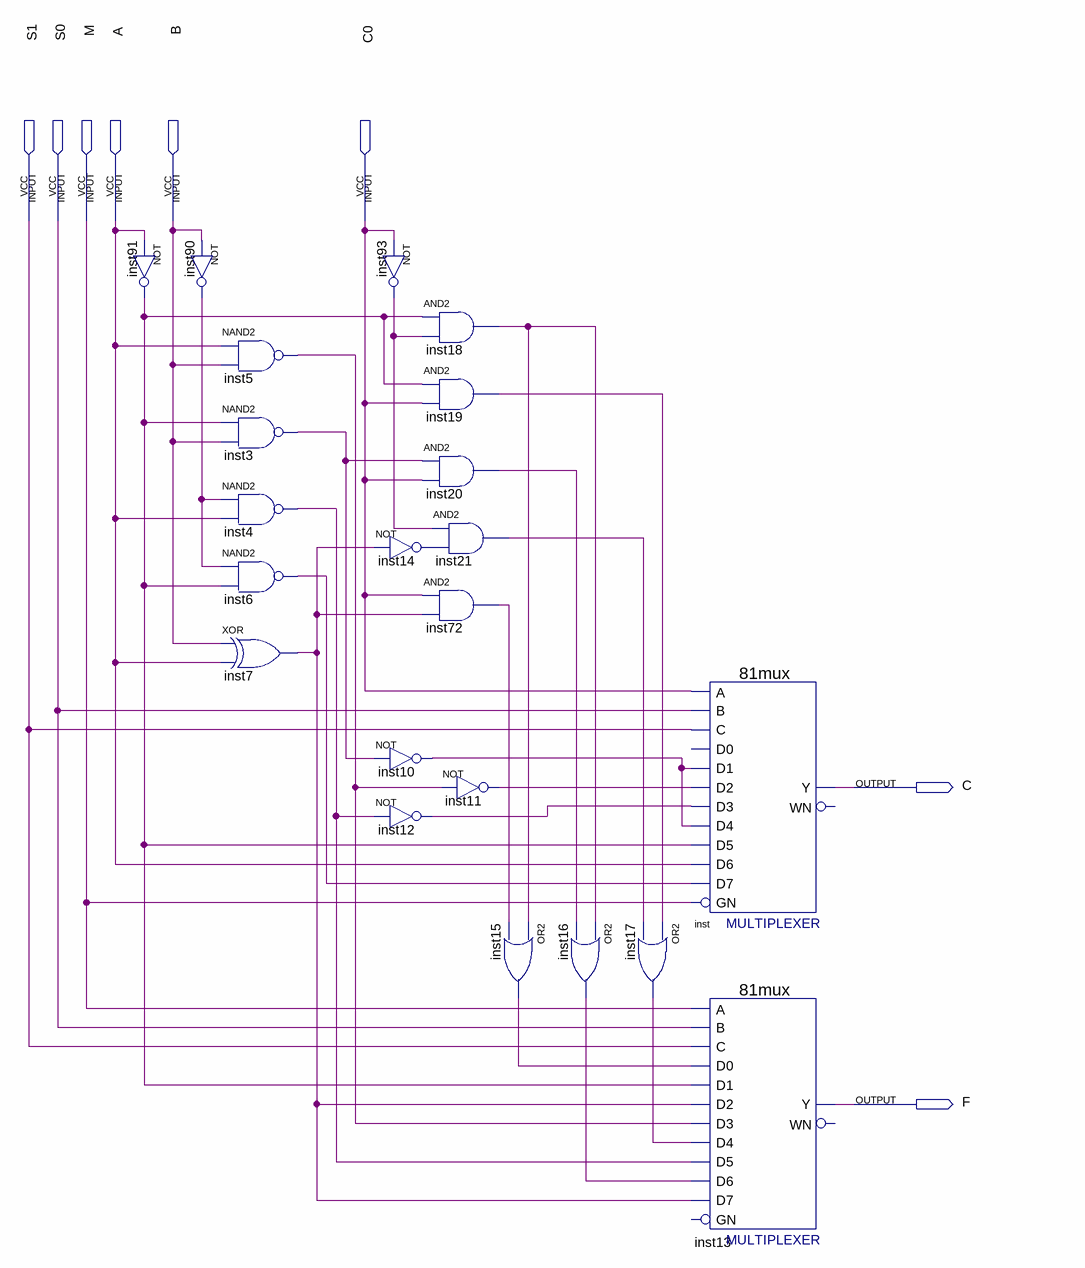
[diagram p0: schematic sheet]
// Quartus schematic q61.bdf as structural Verilog: 22 symbols, 8 pins
module q61 (
  input  S1,
  input  S0,
  input  M,
  input  A,
  input  B,
  input  C0,
  output C,
  output F
);

  wire inst3_out, inst4_out, inst5_out, inst6_out, inst7_out, inst10_out, inst11_out, inst12_out, inst14_out,
       inst15_out, inst16_out, inst17_out, inst18_out, inst19_out, inst20_out, inst21_out, inst72_out,
       inst90_out, inst91_out, inst93_out;

  not inst91 (inst91_out, A);
  not inst90 (inst90_out, B);
  nand inst5 (inst5_out, A, B);
  nand inst3 (inst3_out, inst91_out, B);
  nand inst4 (inst4_out, inst90_out, A);
  nand inst6 (inst6_out, inst90_out, inst91_out);
  xor inst7 (inst7_out, B, A);
  not inst93 (inst93_out, C0);
  not inst14 (inst14_out, inst7_out);
  not inst10 (inst10_out, inst3_out);
  not inst12 (inst12_out, inst4_out);
  and inst18 (inst18_out, inst91_out, inst93_out);
  and inst19 (inst19_out, inst91_out, C0);
  and inst20 (inst20_out, inst3_out, C0);
  and inst21 (inst21_out, inst93_out, inst14_out);
  and inst72 (inst72_out, C0, inst7_out);
  not inst11 (inst11_out, inst5_out);
  or inst15 (inst15_out, inst18_out, inst72_out);
  or inst16 (inst16_out, inst18_out, inst20_out);
  \81mux  inst (
    .C(S1), .D1(inst10_out), .D5(inst91_out), .D4(inst10_out), .D2(inst11_out), .D3(inst12_out), .GN(M),
    .D7(inst6_out), .D6(A), .A(C0), .B(S0), .Y(C));  // open: D0, WN
  or inst17 (inst17_out, inst19_out, inst21_out);
  \81mux  inst13 (
    .C(S1), .D1(inst91_out), .D0(inst15_out), .D5(inst4_out), .D4(inst17_out), .D2(inst7_out),
    .D3(inst5_out), .D7(inst7_out), .D6(inst16_out), .A(M), .B(S0), .Y(F));  // open: GN, WN
endmodule
